# Altium schematic sheet ConBoard_Top.SchDoc: Data Logger - Ports
size A4; DocumentNumber: MB-CON-1; SheetNumber: 1; SheetTotal: 1
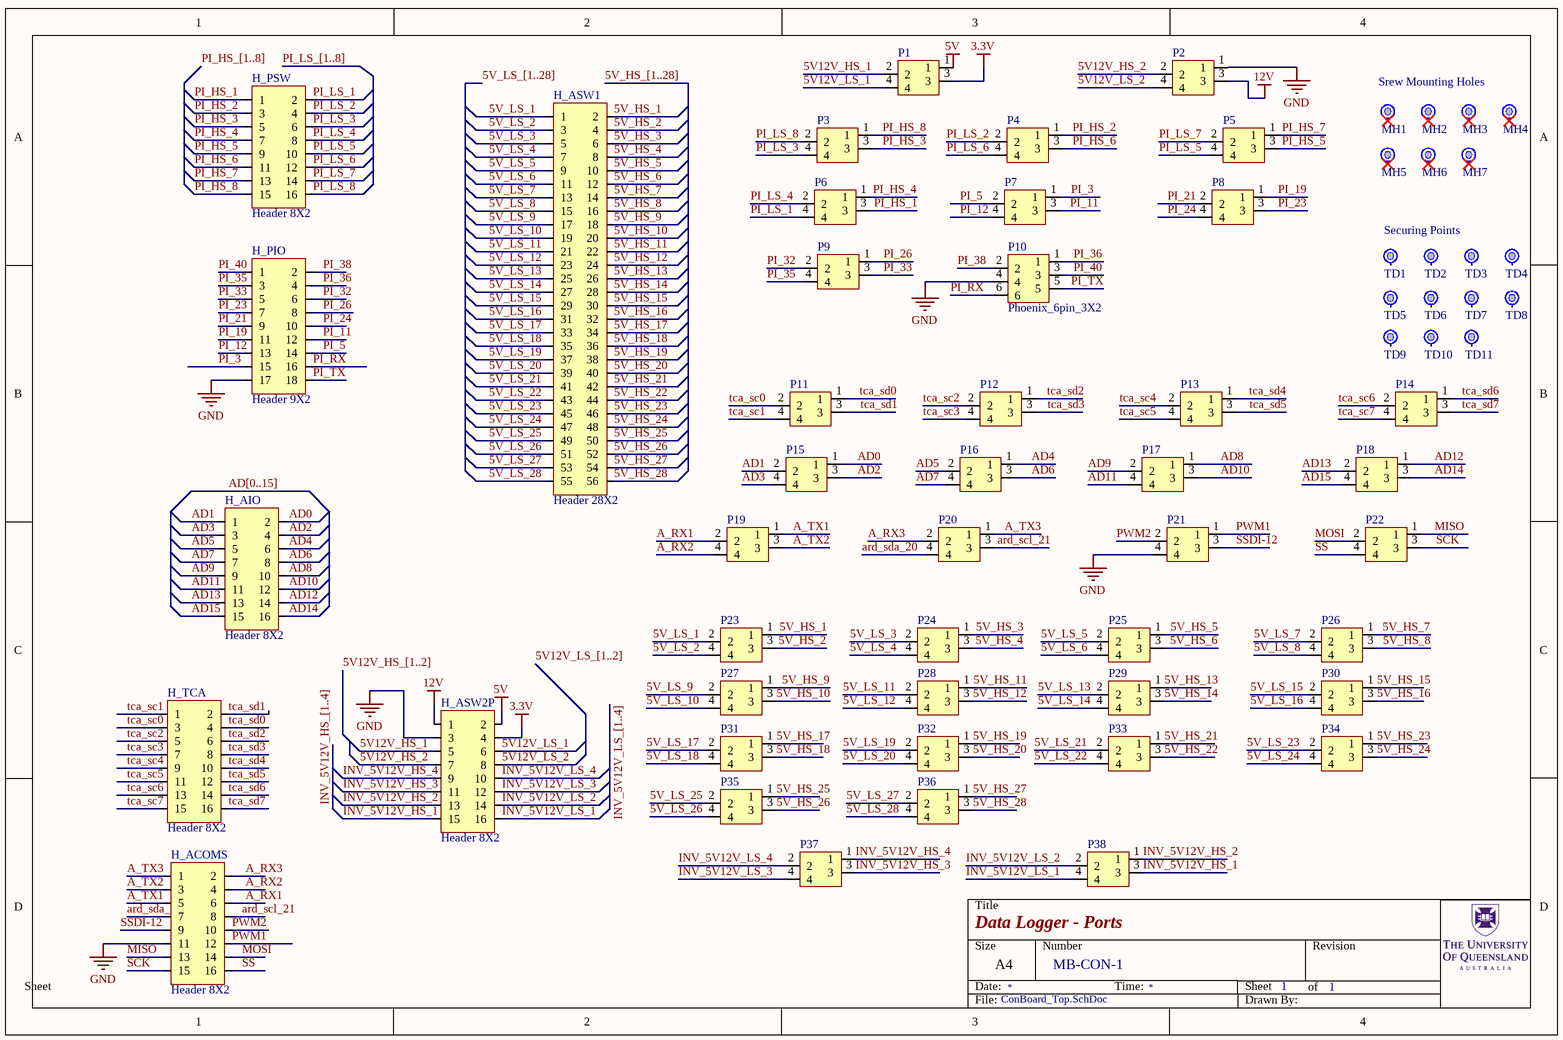
[diagram p0: ConBoard_Top.SchDoc]

## Parts
H_ACOMS  Header 8X2  [HDR2X8]
H_AIO  Header 8X2  [HDR2X8]
H_ASW1  Header 28X2  [HDR2X28]
H_ASW2P  Header 8X2  [HDR2X8]
H_PIO  Header 9X2  [HDR2X9]
H_PSW  Header 8X2  [HDR2X8]
H_TCA  Header 8X2  [HDR2X8]
MH1  MOUNTING_HOLE  [M3]  (value not drawn)
MH2  MOUNTING_HOLE  [M3]  (value not drawn)
MH3  MOUNTING_HOLE  [M3]  (value not drawn)
MH4  MOUNTING_HOLE  [M3]  (value not drawn)
MH5  MOUNTING_HOLE  [M3]  (value not drawn)
MH6  MOUNTING_HOLE  [M3]  (value not drawn)
MH7  MOUNTING_HOLE  [M3]  (value not drawn)
P1  Phoenix_4pin_2X2  [MKKDSN_4PIN-2POS_5.08PITCH_1.5WIRE]  (value not drawn)
P2  Phoenix_4pin_2X2  [MKKDSN_4PIN-2POS_5.08PITCH_1.5WIRE]  (value not drawn)
P3  Phoenix_4pin_2X2  [MKKDSN_4PIN-2POS_5.08PITCH_1.5WIRE]  (value not drawn)
P4  Phoenix_4pin_2X2  [MKKDSN_4PIN-2POS_5.08PITCH_1.5WIRE]  (value not drawn)
P5  Phoenix_4pin_2X2  [MKKDSN_4PIN-2POS_5.08PITCH_1.5WIRE]  (value not drawn)
P6  Phoenix_4pin_2X2  [MKKDSN_4PIN-2POS_5.08PITCH_1.5WIRE]  (value not drawn)
P7  Phoenix_4pin_2X2  [MKKDSN_4PIN-2POS_5.08PITCH_1.5WIRE]  (value not drawn)
P8  Phoenix_4pin_2X2  [MKKDSN_4PIN-2POS_5.08PITCH_1.5WIRE]  (value not drawn)
P9  Phoenix_4pin_2X2  [MKKDSN_4PIN-2POS_5.08PITCH_1.5WIRE]  (value not drawn)
P10  Phoenix_6pin_3X2  [MKKDSN_6PIN-3POS_5.08PITCH_1.5WIRE]
P11  Phoenix_4pin_2X2  [MKKDSN_4PIN-2POS_5.08PITCH_1.5WIRE]  (value not drawn)
P12  Phoenix_4pin_2X2  [MKKDSN_4PIN-2POS_5.08PITCH_1.5WIRE]  (value not drawn)
P13  Phoenix_4pin_2X2  [MKKDSN_4PIN-2POS_5.08PITCH_1.5WIRE]  (value not drawn)
P14  Phoenix_4pin_2X2  [MKKDSN_4PIN-2POS_5.08PITCH_1.5WIRE]  (value not drawn)
P15  Phoenix_4pin_2X2  [MKKDSN_4PIN-2POS_5.08PITCH_1.5WIRE]  (value not drawn)
P16  Phoenix_4pin_2X2  [MKKDSN_4PIN-2POS_5.08PITCH_1.5WIRE]  (value not drawn)
P17  Phoenix_4pin_2X2  [MKKDSN_4PIN-2POS_5.08PITCH_1.5WIRE]  (value not drawn)
P18  Phoenix_4pin_2X2  [MKKDSN_4PIN-2POS_5.08PITCH_1.5WIRE]  (value not drawn)
P19  Phoenix_4pin_2X2  [MKKDSN_4PIN-2POS_5.08PITCH_1.5WIRE]  (value not drawn)
P20  Phoenix_4pin_2X2  [MKKDSN_4PIN-2POS_5.08PITCH_1.5WIRE]  (value not drawn)
P21  Phoenix_4pin_2X2  [MKKDSN_4PIN-2POS_5.08PITCH_1.5WIRE]  (value not drawn)
P22  Phoenix_4pin_2X2  [MKKDSN_4PIN-2POS_5.08PITCH_1.5WIRE]  (value not drawn)
P23  Phoenix_4pin_2X2  [MKKDSN_4PIN-2POS_5.08PITCH_1.5WIRE]  (value not drawn)
P24  Phoenix_4pin_2X2  [MKKDSN_4PIN-2POS_5.08PITCH_1.5WIRE]  (value not drawn)
P25  Phoenix_4pin_2X2  [MKKDSN_4PIN-2POS_5.08PITCH_1.5WIRE]  (value not drawn)
P26  Phoenix_4pin_2X2  [MKKDSN_4PIN-2POS_5.08PITCH_1.5WIRE]  (value not drawn)
P27  Phoenix_4pin_2X2  [MKKDSN_4PIN-2POS_5.08PITCH_1.5WIRE]  (value not drawn)
P28  Phoenix_4pin_2X2  [MKKDSN_4PIN-2POS_5.08PITCH_1.5WIRE]  (value not drawn)
P29  Phoenix_4pin_2X2  [MKKDSN_4PIN-2POS_5.08PITCH_1.5WIRE]  (value not drawn)
P30  Phoenix_4pin_2X2  [MKKDSN_4PIN-2POS_5.08PITCH_1.5WIRE]  (value not drawn)
P31  Phoenix_4pin_2X2  [MKKDSN_4PIN-2POS_5.08PITCH_1.5WIRE]  (value not drawn)
P32  Phoenix_4pin_2X2  [MKKDSN_4PIN-2POS_5.08PITCH_1.5WIRE]  (value not drawn)
P33  Phoenix_4pin_2X2  [MKKDSN_4PIN-2POS_5.08PITCH_1.5WIRE]  (value not drawn)
P34  Phoenix_4pin_2X2  [MKKDSN_4PIN-2POS_5.08PITCH_1.5WIRE]  (value not drawn)
P35  Phoenix_4pin_2X2  [MKKDSN_4PIN-2POS_5.08PITCH_1.5WIRE]  (value not drawn)
P36  Phoenix_4pin_2X2  [MKKDSN_4PIN-2POS_5.08PITCH_1.5WIRE]  (value not drawn)
P37  Phoenix_4pin_2X2  [MKKDSN_4PIN-2POS_5.08PITCH_1.5WIRE]  (value not drawn)
P38  Phoenix_4pin_2X2  [MKKDSN_4PIN-2POS_5.08PITCH_1.5WIRE]  (value not drawn)
TD1  TIEDOWNS  [M3]  (value not drawn)  (no BOM)
TD2  TIEDOWNS  [M3]  (value not drawn)  (no BOM)
TD3  TIEDOWNS  [M3]  (value not drawn)  (no BOM)
TD4  TIEDOWNS  [M3]  (value not drawn)  (no BOM)
TD5  TIEDOWNS  [M3]  (value not drawn)  (no BOM)
TD6  TIEDOWNS  [M3]  (value not drawn)  (no BOM)
TD7  TIEDOWNS  [M3]  (value not drawn)  (no BOM)
TD8  TIEDOWNS  [M3]  (value not drawn)  (no BOM)
TD9  TIEDOWNS  [M3]  (value not drawn)  (no BOM)
TD10  TIEDOWNS  [M3]  (value not drawn)  (no BOM)
TD11  TIEDOWNS  [M3]  (value not drawn)  (no BOM)

## Nets
3.3V: H_ASW2P.4 P1.3
5V: H_ASW2P.2 P1.1
12V: H_ASW2P.1 P2.3
GND: H_ACOMS.11 H_ASW2P.3 H_PIO.17 P2.1 P10.4 P21.4
5V12V_HS_1: H_ASW2P.5 P1.2
5V12V_HS_2: H_ASW2P.7 P2.2
5V12V_LS_1: H_ASW2P.6 P1.4
5V12V_LS_2: H_ASW2P.8 P2.4
5V_HS_1: H_ASW1.2 P23.1
5V_HS_2: H_ASW1.4 P23.3
5V_HS_3: H_ASW1.6 P24.1
5V_HS_4: H_ASW1.8 P24.3
5V_HS_5: H_ASW1.10 P25.1
5V_HS_6: H_ASW1.12 P25.3
5V_HS_7: H_ASW1.14 P26.1
5V_HS_8: H_ASW1.16 P26.3
5V_HS_9: H_ASW1.18 P27.1
5V_HS_10: H_ASW1.20 P27.3
5V_HS_11: H_ASW1.22 P28.1
5V_HS_12: H_ASW1.24 P28.3
5V_HS_13: H_ASW1.26 P29.1
5V_HS_14: H_ASW1.28 P29.3
5V_HS_15: H_ASW1.30 P30.1
5V_HS_16: H_ASW1.32 P30.3
5V_HS_17: H_ASW1.34 P31.1
5V_HS_18: H_ASW1.36 P31.3
5V_HS_19: H_ASW1.38 P32.1
5V_HS_20: H_ASW1.40 P32.3
5V_HS_21: H_ASW1.42 P33.1
5V_HS_22: H_ASW1.44 P33.3
5V_HS_23: H_ASW1.46 P34.1
5V_HS_24: H_ASW1.48 P34.3
5V_HS_25: H_ASW1.50 P35.1
5V_HS_26: H_ASW1.52 P35.3
5V_HS_27: H_ASW1.54 P36.1
5V_HS_28: H_ASW1.56 P36.3
5V_LS_1: H_ASW1.1 P23.2
5V_LS_2: H_ASW1.3 P23.4
5V_LS_3: H_ASW1.5 P24.2
5V_LS_4: H_ASW1.7 P24.4
5V_LS_5: H_ASW1.9 P25.2
5V_LS_6: H_ASW1.11 P25.4
5V_LS_7: H_ASW1.13 P26.2
5V_LS_8: H_ASW1.15 P26.4
5V_LS_9: H_ASW1.17 P27.2
5V_LS_10: H_ASW1.19 P27.4
5V_LS_11: H_ASW1.21 P28.2
5V_LS_12: H_ASW1.23 P28.4
5V_LS_13: H_ASW1.25 P29.2
5V_LS_14: H_ASW1.27 P29.4
5V_LS_15: H_ASW1.29 P30.2
5V_LS_16: H_ASW1.31 P30.4
5V_LS_17: H_ASW1.33 P31.2
5V_LS_18: H_ASW1.35 P31.4
5V_LS_19: H_ASW1.37 P32.2
5V_LS_20: H_ASW1.39 P32.4
5V_LS_21: H_ASW1.41 P33.2
5V_LS_22: H_ASW1.43 P33.4
5V_LS_23: H_ASW1.45 P34.2
5V_LS_24: H_ASW1.47 P34.4
5V_LS_25: H_ASW1.49 P35.2
5V_LS_26: H_ASW1.51 P35.4
5V_LS_27: H_ASW1.53 P36.2
5V_LS_28: H_ASW1.55 P36.4
A_RX1: H_ACOMS.6 P19.2
A_RX2: H_ACOMS.4 P19.4
A_RX3: H_ACOMS.2 P20.2
A_TX1: H_ACOMS.5 P19.1
A_TX2: H_ACOMS.3 P19.3
A_TX3: H_ACOMS.1 P20.1
AD0: H_AIO.2 P15.1
AD1: H_AIO.1 P15.2
AD2: H_AIO.4 P15.3
AD3: H_AIO.3 P15.4
AD4: H_AIO.6 P16.1
AD5: H_AIO.5 P16.2
AD6: H_AIO.8 P16.3
AD7: H_AIO.7 P16.4
AD8: H_AIO.10 P17.1
AD9: H_AIO.9 P17.2
AD10: H_AIO.12 P17.3
AD11: H_AIO.11 P17.4
AD12: H_AIO.14 P18.1
AD13: H_AIO.13 P18.2
AD14: H_AIO.16 P18.3
AD15: H_AIO.15 P18.4
ard_scl_21: H_ACOMS.8 P20.3
ard_sda_20: H_ACOMS.7 P20.4
INV_5V12V_HS_1: H_ASW2P.15 P38.3
INV_5V12V_HS_2: H_ASW2P.13 P38.1
INV_5V12V_HS_3: H_ASW2P.11 P37.3
INV_5V12V_HS_4: H_ASW2P.9 P37.1
INV_5V12V_LS_1: H_ASW2P.16 P38.4
INV_5V12V_LS_2: H_ASW2P.14 P38.2
INV_5V12V_LS_3: H_ASW2P.12 P37.4
INV_5V12V_LS_4: H_ASW2P.10 P37.2
MISO: H_ACOMS.13 P22.1
MOSI: H_ACOMS.14 P22.2
PI_3: H_PIO.15 P7.1
PI_5: H_PIO.14 P7.2
PI_11: H_PIO.12 P7.3
PI_12: H_PIO.13 P7.4
PI_19: H_PIO.11 P8.1
PI_21: H_PIO.9 P8.2
PI_23: H_PIO.7 P8.3
PI_24: H_PIO.10 P8.4
PI_26: H_PIO.8 P9.1
PI_32: H_PIO.6 P9.2
PI_33: H_PIO.5 P9.3
PI_35: H_PIO.3 P9.4
PI_36: H_PIO.4 P10.1
PI_38: H_PIO.2 P10.2
PI_40: H_PIO.1 P10.3
PI_HS_1: H_PSW.1 P6.3
PI_HS_2: H_PSW.3 P4.1
PI_HS_3: H_PSW.5 P3.3
PI_HS_4: H_PSW.7 P6.1
PI_HS_5: H_PSW.9 P5.3
PI_HS_6: H_PSW.11 P4.3
PI_HS_7: H_PSW.13 P5.1
PI_HS_8: H_PSW.15 P3.1
PI_LS_1: H_PSW.2 P6.4
PI_LS_2: H_PSW.4 P4.2
PI_LS_3: H_PSW.6 P3.4
PI_LS_4: H_PSW.8 P6.2
PI_LS_5: H_PSW.10 P5.4
PI_LS_6: H_PSW.12 P4.4
PI_LS_7: H_PSW.14 P5.2
PI_LS_8: H_PSW.16 P3.2
PI_RX: H_PIO.16 P10.6
PI_TX: H_PIO.18 P10.5
PWM1: H_ACOMS.12 P21.1
PWM2: H_ACOMS.10 P21.2
SCK: H_ACOMS.15 P22.3
SS: H_ACOMS.16 P22.4
SSDI-12: H_ACOMS.9 P21.3
tca_sc0: H_TCA.3 P11.2
tca_sc1: H_TCA.1 P11.4
tca_sc2: H_TCA.5 P12.2
tca_sc3: H_TCA.7 P12.4
tca_sc4: H_TCA.9 P13.2
tca_sc5: H_TCA.11 P13.4
tca_sc6: H_TCA.13 P14.2
tca_sc7: H_TCA.15 P14.4
tca_sd0: H_TCA.4 P11.1
tca_sd1: H_TCA.2 P11.3
tca_sd2: H_TCA.6 P12.1
tca_sd3: H_TCA.8 P12.3
tca_sd4: H_TCA.10 P13.1
tca_sd5: H_TCA.12 P13.3
tca_sd6: H_TCA.14 P14.1
tca_sd7: H_TCA.16 P14.3

Not connected (* = marked no-connect by the designer): MH1 0*; MH2 0*; MH3 0*; MH4 0*; MH5 0*; MH6 0*; MH7 0*; TD1 0; TD2 0; TD3 0; TD4 0; TD5 0; TD6 0; TD7 0; TD8 0; TD9 0; TD10 0; TD11 0

## Buses and harness runs
bus 5V12V_HS_[1..2]
bus 5V12V_LS_[1..2]
bus 5V_HS_[1..28]
bus 5V_LS_[1..28]
bus AD[0..15]
bus INV_5V12V_HS_[1..4]
bus INV_5V12V_LS_[1..4]
bus PI_HS_[1..8]
bus PI_LS_[1..8]

## Notes on the sheet
- Srew Mounting Holes
- Securing Points
- Title
- Sheet
- Date:
- Size
- A4
- Number
- Time:
- of
- Revision
- File:
- Drawn By:

## Library data of the parts
H_ACOMS H_AIO H_ASW2P H_PSW H_TCA = Header 8X2: Header, 8-Pin, Dual row; System: Connector; LatestRevisionDate: 17-Jul-2002; LatestRevisionNote: Re-released for DXP Platform.; Publisher: Altium Limited
H_ASW1 = Header 28X2: Header, 28-Pin, Dual row; System: Connector; LatestRevisionDate: 17-Jul-2002; LatestRevisionNote: Re-released for DXP Platform.; Publisher: Altium Limited
H_PIO = Header 9X2: Header, 9-Pin, Dual row; System: Connector; LatestRevisionDate: 17-Jul-2002; LatestRevisionNote: Re-released for DXP Platform.; Publisher: Altium Limited
MH1-MH7 = MOUNTING_HOLE: Value: brd-brd
TD1-TD11 = MOUNTING_HOLE